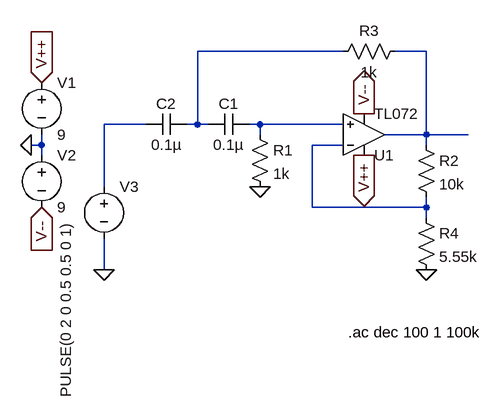
[diagram p0: schematic HighPassSecondOrderSK.asc]
HighPassSecondOrderSK.asc, the LTspice schematic file:
Version 4
SHEET 1 880 680
WIRE 592 96 368 96
WIRE 720 96 672 96
WIRE 288 208 224 208
WIRE 368 208 368 96
WIRE 368 208 352 208
WIRE 384 208 368 208
WIRE 464 208 448 208
WIRE 592 208 464 208
WIRE 464 224 464 208
WIRE 720 224 720 96
WIRE 720 224 656 224
WIRE 784 224 720 224
WIRE 128 240 128 224
WIRE 128 240 112 240
WIRE 592 240 544 240
WIRE 720 240 720 224
WIRE 128 256 128 240
WIRE 224 304 224 208
WIRE 544 336 544 240
WIRE 720 336 720 320
WIRE 720 336 544 336
WIRE 720 352 720 336
WIRE 224 432 224 384
FLAG 112 240 0
FLAG 128 144 V++
IOPIN 128 144 In
FLAG 128 336 V--
IOPIN 128 336 In
FLAG 224 432 0
FLAG 624 192 V--
IOPIN 624 192 Out
FLAG 624 256 V++
IOPIN 624 256 Out
FLAG 720 432 0
FLAG 464 304 0
SYMBOL Voltage 128 128 R0
SYMATTR InstName V1
SYMATTR Value 9
SYMBOL Voltage 128 240 R0
SYMATTR InstName V2
SYMATTR Value 9
SYMBOL Voltage 224 288 R0
WINDOW 3 -59 70 VRight 2
SYMATTR Value PULSE(0 2 0 0.5 0.5 0 1)
SYMATTR InstName V3
SYMATTR Value2 AC 1
SYMBOL OpAmps/TL072 624 288 M180
SYMATTR InstName U1
SYMBOL Res 704 224 R0
SYMATTR InstName R2
SYMATTR Value 10k
SYMBOL Res 704 336 R0
SYMATTR InstName R4
SYMATTR Value 5.55k
SYMBOL Res 448 208 R0
SYMATTR InstName R1
SYMATTR Value 1k
SYMBOL Res 688 80 R90
WINDOW 0 0 56 VBottom 2
WINDOW 3 32 56 VTop 2
SYMATTR InstName R3
SYMATTR Value 1k
SYMBOL Cap 448 192 R90
WINDOW 0 0 32 VBottom 2
WINDOW 3 32 32 VTop 2
SYMATTR InstName C1
SYMATTR Value 0.1µ
SYMBOL Cap 352 192 R90
WINDOW 0 0 32 VBottom 2
WINDOW 3 32 32 VTop 2
SYMATTR InstName C2
SYMATTR Value 0.1µ
TEXT 600 528 Left 2 !.ac dec 100 1 100k

The netlist it stands for:
* HighPassSecondOrderSK.asc
V1 V++ 0 9
V2 0 V-- 9
V3 N003 0 PULSE(0 2 0 0.5 0.5 0 1) AC 1
XU1 N004 N005 V++ V-- N002 TL072  ; pins In+ In- V+ V- OUT
R2 N002 N005 10k
R4 N005 0 5.55k
R1 N004 0 1k
R3 N002 N001 1k
C1 N004 N001 0.1µ
C2 N001 N003 0.1µ
.ac dec 100 1 100k
.backanno
.end